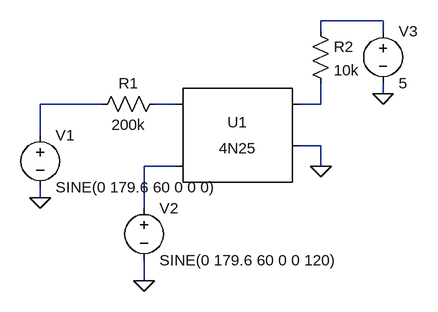
[diagram p0: schematic Draft4.asc]
Draft4.asc, the LTspice schematic file:
Version 4
SHEET 1 880 680
WIRE 528 -16 432 -16
WIRE 432 0 432 -16
WIRE 528 0 528 -16
WIRE 528 96 528 80
WIRE 96 112 0 112
WIRE 208 112 176 112
WIRE 432 112 432 80
WIRE 432 112 400 112
WIRE 0 160 0 112
WIRE 432 176 400 176
WIRE 208 208 160 208
WIRE 432 208 432 176
WIRE 0 256 0 240
WIRE 160 272 160 208
WIRE 160 384 160 352
FLAG 0 256 0
FLAG 160 384 0
FLAG 432 208 0
FLAG 528 96 0
SYMBOL res 80 128 R270
WINDOW 0 32 56 VTop 2
WINDOW 3 0 56 VBottom 2
SYMATTR InstName R1
SYMATTR Value 200k
SYMATTR SpiceLine tol=5 pwr=0.25
SYMBOL Optos\\4N25 304 176 R0
SYMATTR InstName U1
SYMBOL voltage 0 144 R0
WINDOW 123 0 0 Left 2
WINDOW 39 0 0 Left 2
SYMATTR InstName V1
SYMATTR Value SINE(0 179.6 60 0 0 0)
SYMBOL voltage 160 256 R0
WINDOW 123 0 0 Left 2
WINDOW 39 0 0 Left 2
SYMATTR InstName V2
SYMATTR Value SINE(0 179.6 60 0 0 120)
SYMBOL res 416 -16 R0
SYMATTR InstName R2
SYMATTR Value 10k
SYMATTR SpiceLine tol=5 pwr=0.25
SYMBOL voltage 528 -16 R0
WINDOW 123 0 0 Left 2
WINDOW 39 0 0 Left 2
SYMATTR InstName V3
SYMATTR Value 5

The netlist it stands for:
* Draft4.asc
R1 N002 N003 200k tol=5 pwr=0.25
XU1 N003 N005 N004 0 NC_01 4N25
V1 N002 0 SINE(0 179.6 60 0 0 0)
V2 N005 0 SINE(0 179.6 60 0 0 120)
R2 N001 N004 10k tol=5 pwr=0.25
V3 N001 0 5
.lib 4N25.sub
.backanno
.end